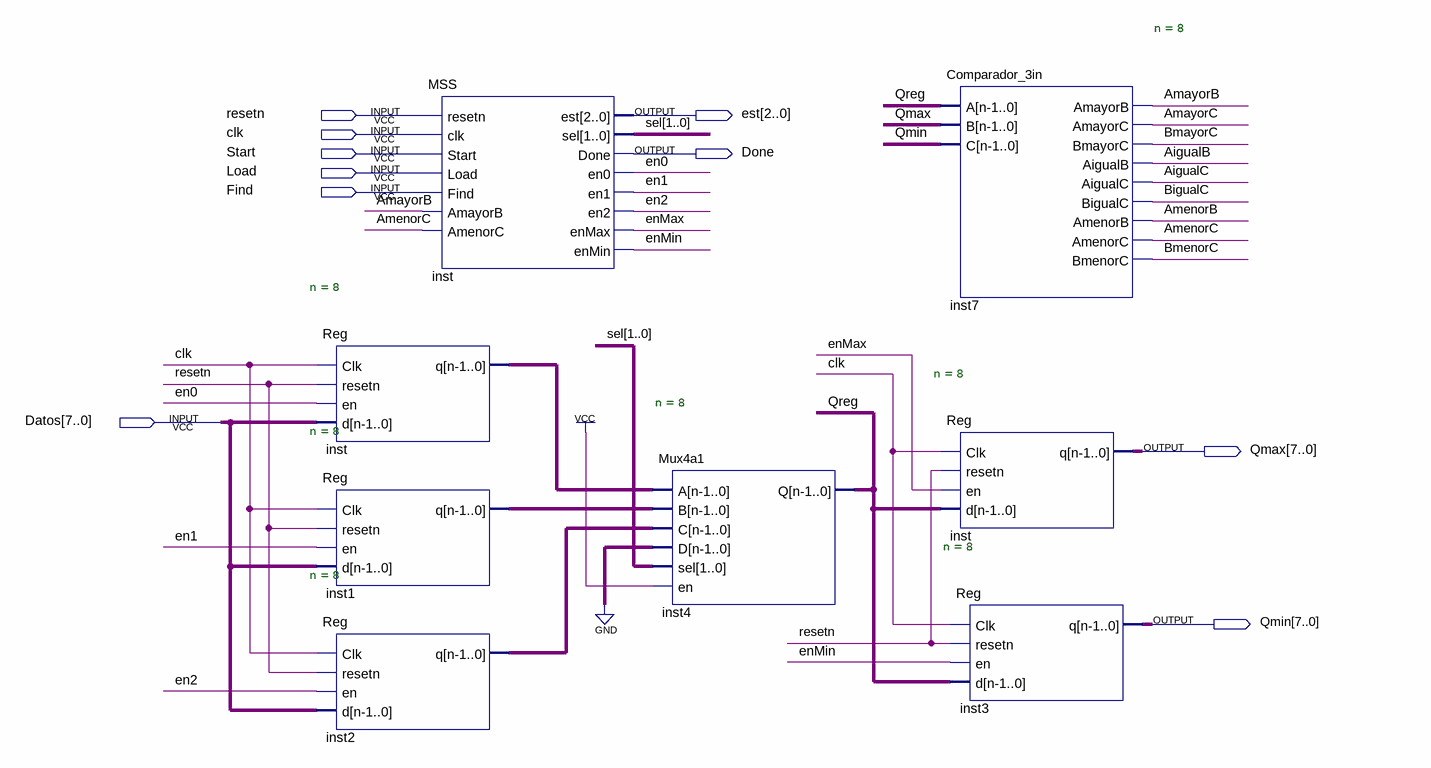
[diagram p0: schematic sheet]
// Quartus schematic Examen.bdf as structural Verilog: 8 symbols, 10 pins
module Examen (
  input  resetn,
  input  clk,
  input  Start,
  input  Load,
  input  Find,
  input  [7:0] Datos,
  output [2:0] est,
  output Done,
  output [7:0] Qmax,
  output [7:0] Qmin
);

  wire AigualB, AigualC, AmayorB, AmayorC, AmenorB, AmenorC, BigualC, BmayorC, BmenorC, en0, en1, en2, enMax,
       enMin, Qmax_1bit, Qmin_1bit, Qreg;
  wire [1:0] sel;
  wire [7:0] inst1_q, inst2_q, inst_q;

  Reg #(.n(8)) inst (.Clk(clk), .resetn(resetn), .en(en0), .d(Datos), .q(inst_q));
  Reg #(.n(8)) inst1 (.Clk(clk), .resetn(resetn), .en(en1), .d(Datos), .q(inst1_q));
  Reg #(.n(8)) inst2 (.Clk(clk), .resetn(resetn), .en(en2), .d(Datos), .q(inst2_q));
  MSS inst_dup2 (
    .resetn(resetn), .clk(clk), .Start(Start), .Load(Load), .Find(Find), .AmayorB(AmayorB),
    .AmenorC(AmenorC), .est(est), .sel(sel), .Done(Done), .en0(en0), .en1(en1), .en2(en2), .enMax(enMax),
    .enMin(enMin));
  Mux4a1 #(.n(8)) inst4 (.A(inst_q), .B(inst1_q), .C(inst2_q), .D({8{1'b0}}), .sel(sel), .en(1'b1), .Q(Qreg));
  Comparador_3in #(.n(8)) inst7 (
    .A({8{Qreg}}), .B({8{Qmax_1bit}}), .C({8{Qmin_1bit}}), .AmayorB(AmayorB), .AmayorC(AmayorC),
    .BmayorC(BmayorC), .AigualB(AigualB), .AigualC(AigualC), .BigualC(BigualC), .AmenorB(AmenorB),
    .AmenorC(AmenorC), .BmenorC(BmenorC));
  Reg #(.n(8)) inst_dup3 (.Clk(clk), .resetn(resetn), .en(enMax), .d({8{Qreg}}), .q(Qmax));
  Reg #(.n(8)) inst3 (.Clk(clk), .resetn(resetn), .en(enMin), .d({8{Qreg}}), .q(Qmin));
endmodule
